# Altium schematic sheet Sheet1_PWR_connectors.SchDoc: Koruza Expander Board
size A4; Date: 12.7.2016; Author: Matej Gomboc; CompanyName: Institute IRNAS Rače; Revision: 1.0; SheetNumber: 1; SheetTotal: 4; CurrentDate: 12.7.2016
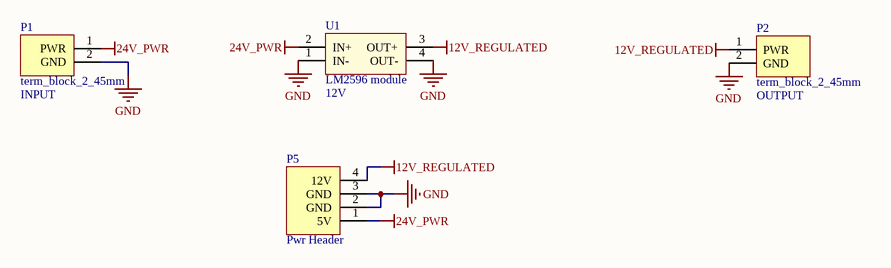
[diagram p0: Sheet1_PWR_connectors.SchDoc]

## Parts
P1  term_block_2_45mm  Direction: INPUT  [term_block_2_45mm]
P2  term_block_2_45mm  Direction: OUTPUT  [term_block_2_45mm]
P5  Pwr Header  [HDR1X4_CONN]
U1  LM2596 module  value 12V  [LM2596 module]

## Nets
12V_REGULATED: P2.1(PWR) P5.4(12V) U1.3(OUT+)
24V_PWR: P1.1(PWR) P5.1(5V) U1.2(IN+)
GND: P1.2(GND) P2.2(GND) P5.2(GND) P5.3(GND) U1.1(IN-) U1.4(OUT-)

## Library data of the parts
P1 P2 = term_block_2_45mm: terminal block, 2.45mm
P5 = 1x4_pwr_header: 1X4 Pwr Header